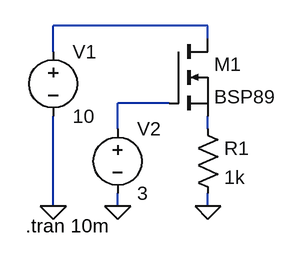
[diagram p0: schematic Draft1.asc]
Draft1.asc, the LTspice schematic file:
Version 4
SHEET 1 880 680
WIRE 208 80 16 80
WIRE 208 96 208 80
WIRE 16 112 16 80
WIRE 160 176 96 176
WIRE 96 208 96 176
WIRE 208 208 208 192
WIRE 16 304 16 192
WIRE 96 304 96 288
WIRE 208 304 208 288
FLAG 208 304 0
FLAG 16 304 0
FLAG 96 304 0
SYMBOL nmos 160 96 R0
SYMATTR InstName M1
SYMATTR Value BSP89
SYMBOL voltage 16 96 R0
WINDOW 123 0 0 Left 0
WINDOW 39 0 0 Left 0
SYMATTR InstName V1
SYMATTR Value 10
SYMBOL res 192 192 R0
SYMATTR InstName R1
SYMATTR Value 1k
SYMBOL voltage 96 192 R0
WINDOW 123 0 0 Left 0
WINDOW 39 0 0 Left 0
SYMATTR InstName V2
SYMATTR Value 3
TEXT -18 328 Left 2 !.tran 10m

The netlist it stands for:
* Draft1.asc
M1 N001 N002 N003 N003 BSP89
V1 N001 0 10
R1 N003 0 1k
V2 N002 0 3
.model NMOS NMOS
.model PMOS PMOS
.lib standard.mos
.tran 10m
.backanno
.end